# Altium schematic sheet 3 MCU.SchDoc
size A3 portrait; DocumentNumber: 3; SheetNumber: 3; SheetTotal: 5; PageSetup: Record=PageOptions|CenterHorizontal=True|CenterVertical=True|PrintScale=1.00|XCorrection=1.00|YCorrection=1.00|PrintKind=1|BorderSize=5000000|LeftOffset=0|BottomOffset=0|Orientation=2|PaperLength=1000|PaperWidth=1000|Scale=100|PaperSource=15|PrintQuality=1200|MediaType=1|DitherType=10|PaperKind=A3|PrintScaleMode=1; Weight: -; ScaleFactor: -; NormInspection: Норм.Контр.; DocumentName: Sheet1.SCHDOC
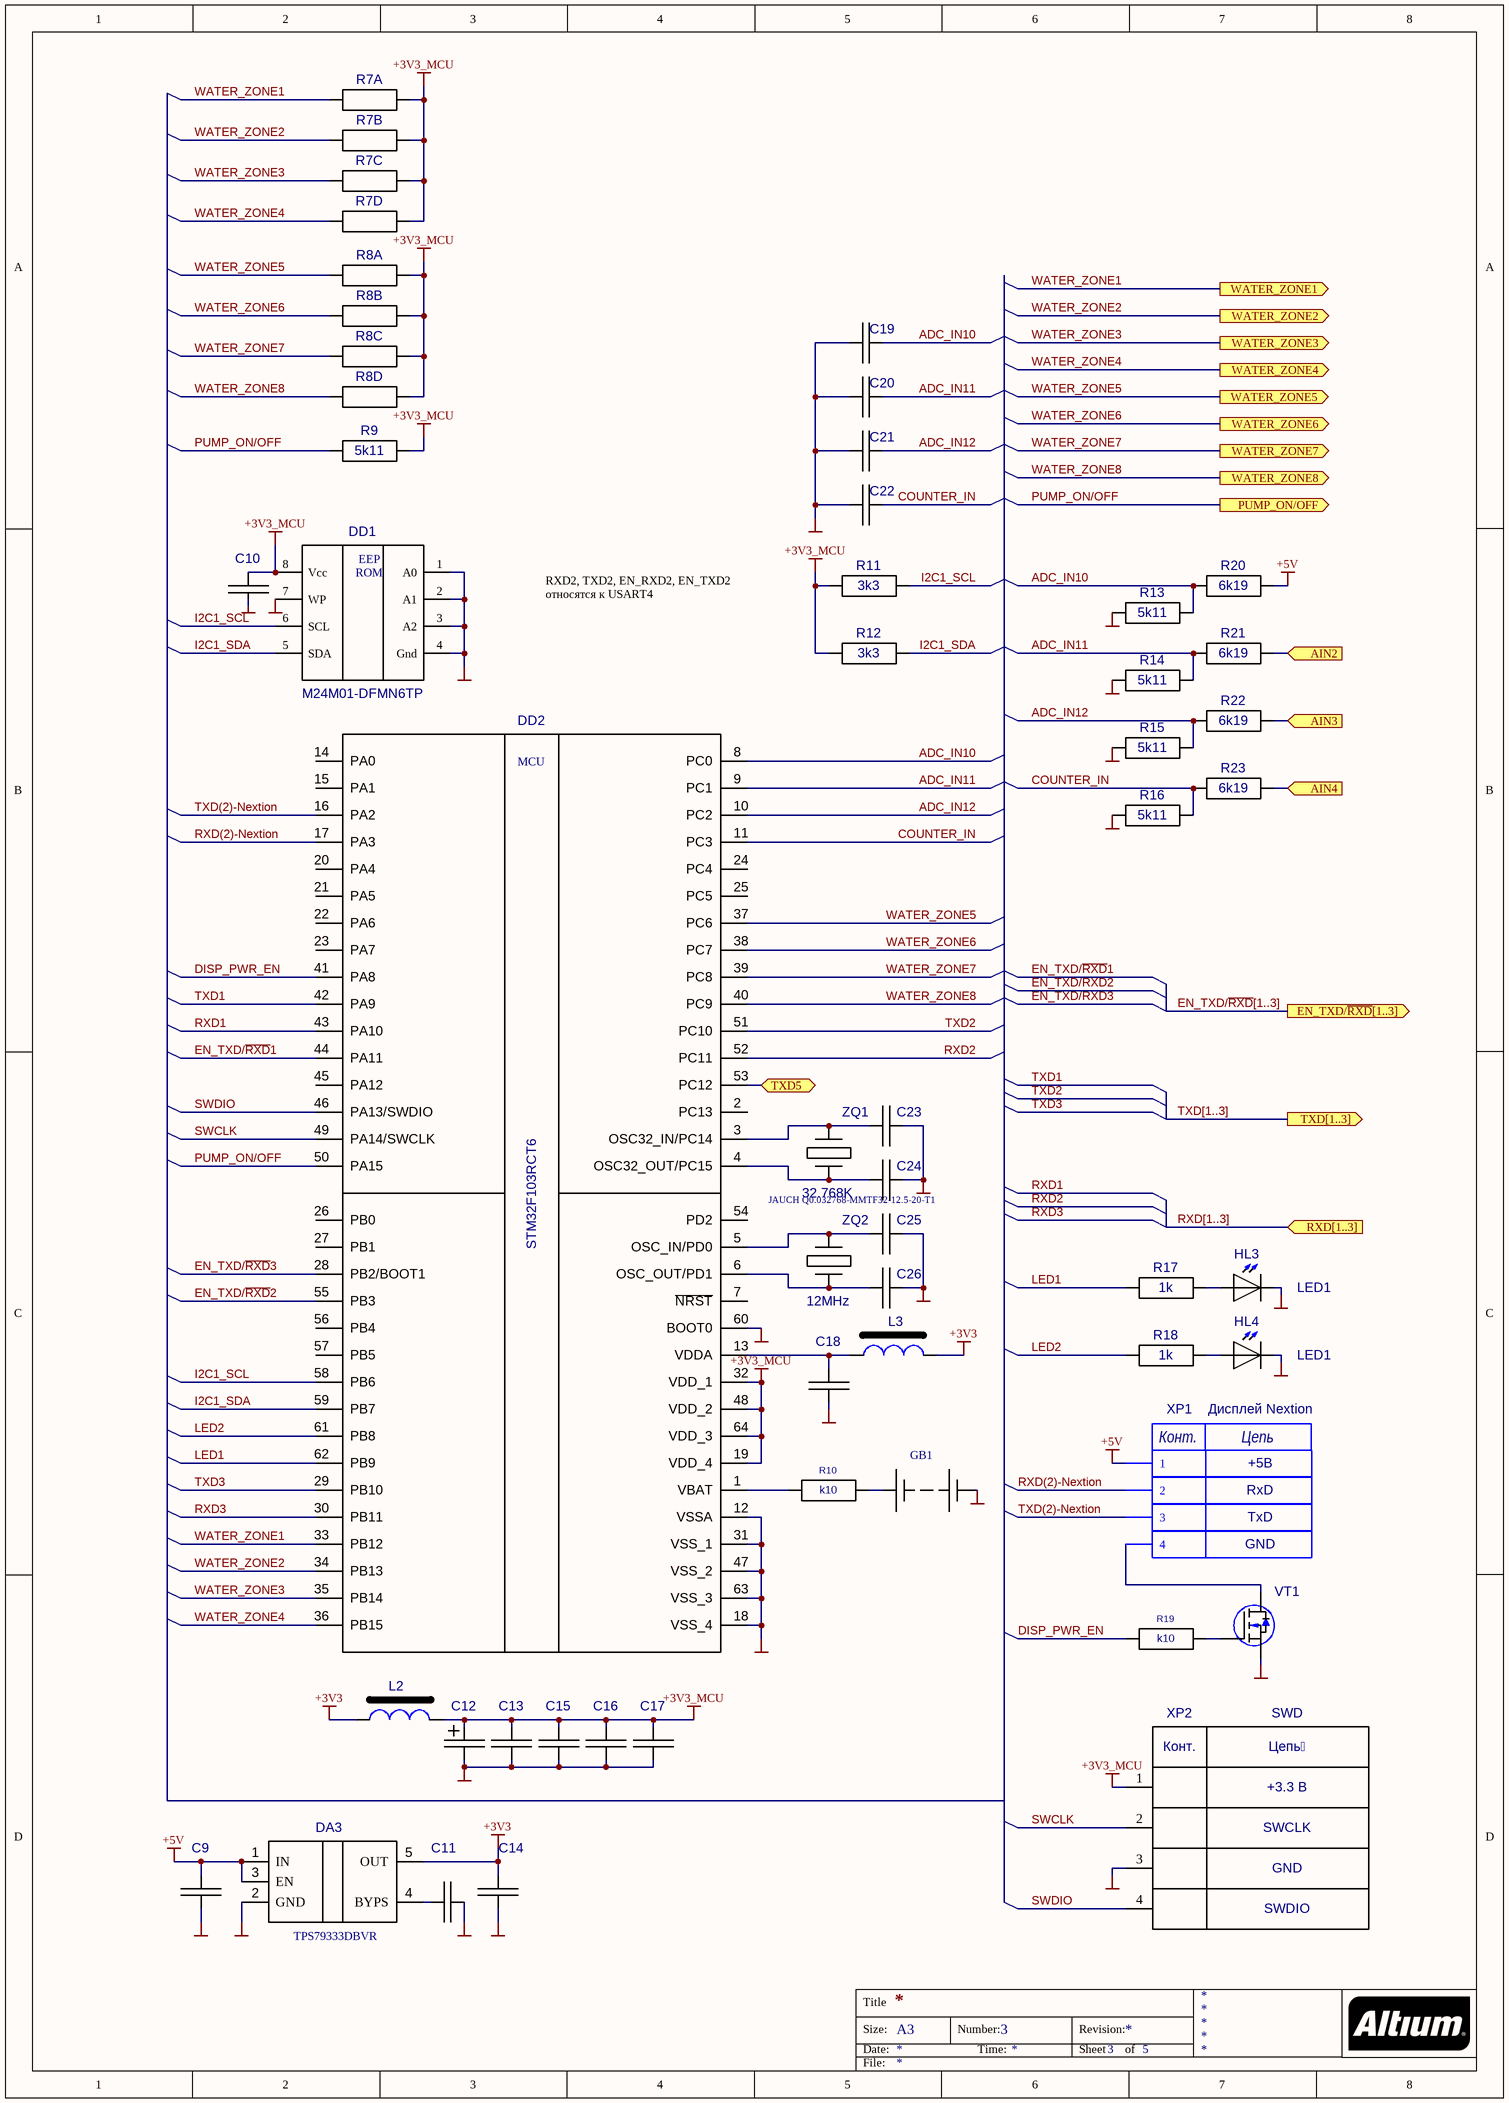
[diagram p0: 3 MCU.SchDoc]

## Parts
?  Con-GOST-Cap  (value not drawn)  (graphical)
C9  C0603  [0603_CAP]  (value not drawn)
C10  C0402  [0402_CAP]  (value not drawn)
C11  C0603  [0603_CAP]  (value not drawn)
C12  220.0x6.3V  [TC6032-C]  (value not drawn)
C13  C0402  [0402_CAP]  (value not drawn)
C14  C0603  [0603_CAP]  (value not drawn)
C15  C0402  [0402_CAP]  (value not drawn)
C16  C0402  [0402_CAP]  (value not drawn)
C17  C0402  [0402_CAP]  (value not drawn)
C18  C0402  [0402_CAP]  (value not drawn)
C19  C0603  [0603_CAP]  (value not drawn)
C20  C0603  [0603_CAP]  (value not drawn)
C21  C0603  [0603_CAP]  (value not drawn)
C22  C0603  [0603_CAP]  (value not drawn)
C23  18pF  [0603_CAP]  (value not drawn)
C24  18pF  [0603_CAP]  (value not drawn)
C25  22pF  [0603_CAP]  (value not drawn)
C26  22pF  [0603_CAP]  (value not drawn)
DA3  TPS79333DBVR  [SOT23-5]
DD1  M24M01-DFMN6TP  [SO8]
DD2  STM32F103RCT6  [LQFP64]
GB1  KLS5-CR2032-03 + Battery CR2032  [CR2032P]  (value not drawn)
HL3  KP-2012SYC  [KP-2012_YEL]  (value not drawn)
HL4  KP-2012SYC  [KP-2012_YEL]  (value not drawn)
L2  BLM18PG  [0603_BLM18]  (value not drawn)
L3  BLM18PG  [0603_BLM18]  (value not drawn)
R7  4k7 CAT16-472J4  [CAT16]  (value not drawn)  (parts A,B,C,D of 4)
R8  4k7 CAT16-472J4  [CAT16]  (value not drawn)  (parts A,B,C,D of 4)
R9  5k11  [0603_RES]
R10  k10  [0603_RES]
R11  value 3k3  [0603_RES]  (hidden comment: R0603)
R12  value 3k3  [0603_RES]  (hidden comment: R0603)
R13  value 5k11  [0603_RES]  (hidden comment: R0603)
R14  value 5k11  [0603_RES]  (hidden comment: R0603)
R15  value 5k11  [0603_RES]  (hidden comment: R0603)
R16  value 5k11  [0603_RES]  (hidden comment: R0603)
R17  value 1k  [0603_RES]  (hidden comment: R0603)
R18  value 1k  [0603_RES]  (hidden comment: R0603)
R19  k10  [0603_RES]
R20  value 6k19  [0603_RES]  (hidden comment: R0603)
R21  value 6k19  [0603_RES]  (hidden comment: R0603)
R22  value 6k19  [0603_RES]  (hidden comment: R0603)
R23  value 6k19  [0603_RES]  (hidden comment: R0603)
VT1  MMBF170Q-7-F  [SOT-23 MOSFET]  (value not drawn)
XP1  DS1022-1*4RDF11-B  [PLS-4RR]  (value not drawn)  (parts A,B,C,D of 4)
XP2  PLD2-6  [PLD2-6]  (value not drawn)  (parts A,B,C,D of 6)
ZQ1  value 32.768K  [1206_NX3215SA]  (hidden comment: NX3215SA-32.768K-STD-MUA-8)
ZQ2  12MHz  [HC49SM]

## Ports
AIN2 (in), AIN3 (in), AIN4 (in), EN_TXD/~{RXD}[1..3] (out), PUMP_ON/OFF (out), RXD[1..3] (in), TXD5 (bidir), TXD[1..3] (out), WATER_ZONE1 (out), WATER_ZONE2 (out), WATER_ZONE3 (out), WATER_ZONE4 (out), WATER_ZONE5 (out), WATER_ZONE6 (out), WATER_ZONE7 (out), WATER_ZONE8 (out)

## Nets
+3V3: C14.1 DA3.5(OUT) L2.1 L3.1
+3V3_MCU: C10.1 C12.1 C13.1 C15.1 C16.1 C17.1 DD1.8(Vcc) DD2.19(VDD_4) DD2.32(VDD_1) DD2.48(VDD_2) DD2.64(VDD_3) L2.2 R7.2 R7.4 R7.6 R7.8 R8.2 R8.4 R8.6 R8.8 R9.2 R11.2 R12.2 XP2.1
+5V: C9.2 DA3.1(IN) DA3.3(EN) R20.1 XP1.1
GND: C9.1 C10.2 C11.2 C12.2 C13.2 C14.2 C15.2 C16.2 C17.2 C18.2 C19.2 C20.2 C21.2 C22.2 C23.2 C24.2 C25.2 C26.2 DA3.2(GND) DD1.1(A0) DD1.2(A1) DD1.3(A2) DD1.4(Gnd) DD1.7(WP) DD2.12(VSSA) DD2.18(VSS_4) DD2.31(VSS_1) DD2.47(VSS_2) DD2.60(BOOT0) DD2.63(VSS_3) GB1.2(-) HL3.2(K) HL4.2(K) R13.2 R14.2 R15.2 R16.2 VT1.2(S) XP2.3
ADC_IN10: C19.1 DD2.8(PC0) R13.1 R20.2
ADC_IN11: C20.1 DD2.9(PC1) R14.1 R21.2
ADC_IN12: C21.1 DD2.10(PC2) R15.1 R22.2
AIN2: R21.1 ; port AIN2
AIN3: R22.1 ; port AIN3
AIN4: R23.1 ; port AIN4
COUNTER_IN: C22.1 DD2.11(PC3) R16.1 R23.2
DISP_PWR_EN: DD2.41(PA8) R19.1
EN_TXD/~{RXD}1: DD2.44(PA11)
EN_TXD/~{RXD}2: DD2.55(PB3)
EN_TXD/~{RXD}3: DD2.28(PB2/BOOT1)
I2C1_SCL: DD1.6(SCL) DD2.58(PB6) R11.1
I2C1_SDA: DD1.5(SDA) DD2.59(PB7) R12.1
LED1: DD2.62(PB9) R17.1
LED2: DD2.61(PB8) R18.1
PUMP_ON/OFF: DD2.50(PA15) R9.1 ; port PUMP_ON/OFF
RXD1: DD2.43(PA10)
RXD2: DD2.52(PC11)
RXD3: DD2.30(PB11)
RXD(2)-Nextion: DD2.17(PA3) XP1.2
SWCLK: DD2.49(PA14/SWCLK) XP2.2
SWDIO: DD2.46(PA13/SWDIO) XP2.4
TXD1: DD2.42(PA9)
TXD2: DD2.51(PC10)
TXD3: DD2.29(PB10)
TXD5: DD2.53(PC12) ; port TXD5
TXD(2)-Nextion: DD2.16(PA2) XP1.3
WATER_ZONE1: DD2.33(PB12) R7.1 ; port WATER_ZONE1
WATER_ZONE2: DD2.34(PB13) R7.3 ; port WATER_ZONE2
WATER_ZONE3: DD2.35(PB14) R7.5 ; port WATER_ZONE3
WATER_ZONE4: DD2.36(PB15) R7.7 ; port WATER_ZONE4
WATER_ZONE5: DD2.37(PC6) R8.1 ; port WATER_ZONE5
WATER_ZONE6: DD2.38(PC7) R8.3 ; port WATER_ZONE6
WATER_ZONE7: DD2.39(PC8) R8.5 ; port WATER_ZONE7
WATER_ZONE8: DD2.40(PC9) R8.7 ; port WATER_ZONE8
NetC11_1: C11.1 DA3.4(BYPS)
NetC18_1: C18.1 DD2.13(VDDA) L3.2
NetC23_1: C23.1 DD2.3(OSC32_IN/PC14) ZQ1.1
NetC24_1: C24.1 DD2.4(OSC32_OUT/PC15) ZQ1.2
NetC25_1: C25.1 DD2.5(OSC_IN/PD0) ZQ2.2
NetC26_1: C26.1 DD2.6(OSC_OUT/PD1) ZQ2.1
NetDD2_1: DD2.1(VBAT) R10.1
NetGB1_1: GB1.1(+) R10.2
NetHL3_1: HL3.1(A) R17.2
NetHL4_1: HL4.1(A) R18.2
NetR19_2: R19.2 VT1.1(G)
NetVT1_3: VT1.3(D) XP1.4

Not connected (* = marked no-connect by the designer): DD2 2(PC13) 7(~{NRST}) 14(PA0) 15(PA1) 20(PA4) 21(PA5) 22(PA6) 23(PA7) 24(PC4) 25(PC5) 26(PB0) 27(PB1) 45(PA12) 54(PD2) 56(PB4) 57(PB5)

## Buses and harness runs
bus EN_TXD/~{RXD}[1..3] = port EN_TXD/~{RXD}[1..3]
bus RXD[1..3] = port RXD[1..3]
bus TXD[1..3] = port TXD[1..3]

## Notes on the sheet
- RXD2, TXD2, EN_RXD2, EN_TXD2
  относятся к USART4
- JAUCH Q0.032768-MMTF32-12.5-20-T1
- LED1
- XP1
- (near ?) Дисплей Nextion
- TxD
- (near ?) RxD
- (near ?) +5B
- (near VT1) GND
- XP2
- SWD
- (near XP2) Конт.
- +3.3 B
- Цепь
- SWCLK
- SWDIO
- GND
- Title
- Size:
- Date:
- A3
- Number:
- Time:
- Revision:
- Sheet
- of
- File:
- (in symbol AT24C32AN-10SU) EEP; ROM
- (in symbol Connector GOST Cap) Конт.; Цепь
- (in symbol STM32F103RXT) MCU

## Library data of the parts
? = Connector GOST Cap: Шапка разъёма ГОСТ; ID: 65; Connector Type: Male; Surface Finish: Gold; Pitch: 2.54mm; Value: Connector GOST Cap; Published: 08.04.2020; Type: Шапка разъёма ГОСТ; Part Number: Connector GOST Cap
C9 C14 = C0603: Value: 2µ2x10V X7R
C10 C13 C15-C18 = C0402: Value: µ10x10V X7R
C11 C19-C22 = C0603: Value: 10nFx50V X7R
C12 = TC6032-C: Value: 220.0x6.3V
C23 C24 = C0603: Value: 18pFx50V NP0
C25 C26 = C0603: Value: 22pFx50V NP0
DD1 = AT24C32AN-10SU: Two-wire / Serial EEPROM / 32K (4096 x 8); Value: M24M01-DFMN6TP
DD2 = STM32F103RXT: Value: STM32F103RCT6
GB1 = Battery 2032: Voltage: 3V; Part Number: KLS5-CR2032-03 + Battery CR2032; Footprint Patch: connector.pcblib; BOM: CR2032P; ComponentLink1Description: Datasheet; Manufacturer: *; Manufacturer Part Number: *; Category: Battery; Value: KLS5-CR2032-03
HL3 HL4 = KP-2012: Value: KP-2012SYC
L2 L3 = BLM18PG: Value: 470R BLM18PG471SN1D
R7 R8 = CAT16: CAT16-472J4; Value: 4k7 CAT16-472J4
R9 R10 R19 = R0603
  R9: Value: 5k11
  R10 R19: Value: k10
VT1 = MMBF170: Value: MMBF170Q-7-F
XP1 = PLS-4R-Rectan: ID: 70; Limit Voltage: 250V; Limit Current: 3A; Connector Type: Male; Resistance: 15momh; Surface Finish: Gold; Pitch: 2.54mm; Value: DS1022-1*4RDF11-B; Published: 08.04.2020; Type: Краевые контакты печатным способом; Part Number: PLS-4R-Rectan; Pins: 4
XP2 = PLD2-6: Value: DS1025-05-2*3P8BV1-B
ZQ2 = HC49SM: Value: 12MHz HC49SM
DA3 = TPS79333DBVR: Value: TPS79333DBVR